# Altium schematic sheet Power.SchDoc: Power
size A4; DocumentNumber: MB1165; Revision: C.1; SheetNumber: 3; SheetTotal: 17; Project: STM32469I-EVAL
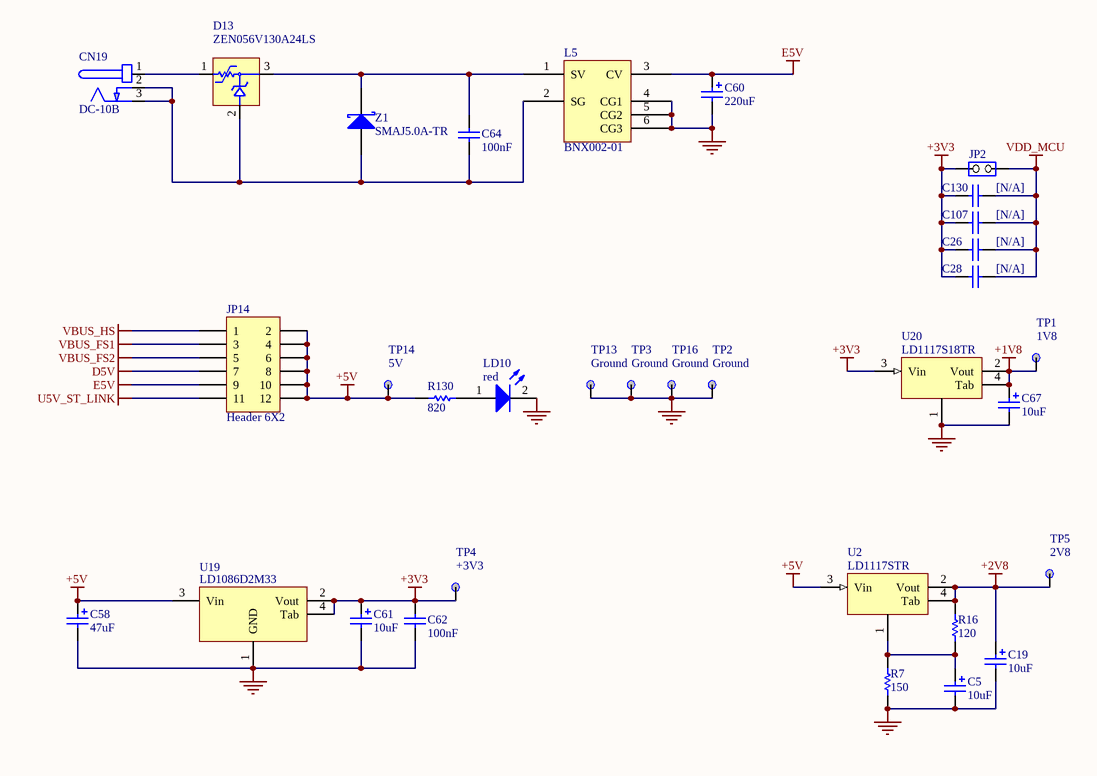
[diagram p0: Power.SchDoc]

## Parts
C5  10uF  [TAN-A]
C19  10uF  [TAN-A]
C26  [N/A]  [0603C]
C28  [N/A]  [0603C]
C58  47uF  [CAE_5R3X5R3_H5R4]
C60  220uF  [c310m-6]
C61  10uF  [TAN-A]
C62  100nF  [0603C]
C64  100nF  [0603C]
C67  10uF  [TAN-A]
C107  [N/A]  [0603C]
C130  [N/A]  [0603C]
CN19  DC-10B  [PWR_JACK_DC10]
D13  ZEN056V130A24LS  [TYCO_ZEN056V130A24LS]
JP2  (no value)  [SIP2]
JP14  Header 6X2  [HDR_2X6_2R54]
L5  BNX002-01  [BNX001]
LD10  red  [0603D]
R7  150  [0603R]
R16  120  [0603R]
R130  820  [0603R]
TP1  1V8  [TP]
TP2  Ground  [TP]
TP3  Ground  [TP]
TP4  +3V3  [TP]
TP5  2V8  [TP]
TP13  Ground  [TP]
TP14  5V  [TP]
TP16  Ground  [TP]
U2  LD1117STR  [SOT-223]
U19  LD1086D2M33  [TO263-3]
U20  LD1117S18TR  [SOT-223]
Z1  SMAJ5.0A-TR  [sma]

## Nets
+1V8: C67.1 TP1.1 U20.2(Vout) U20.4(Tab)
+2V8: C19.1 R16.1 TP5.1 U2.2(Vout) U2.4(Tab)
+3V3: C26.1 C28.1 C61.1 C62.1 C107.1 C130.1 JP2.1(COMMON) TP4.1 U19.2(Vout) U19.4(Tab) U20.3(Vin)
+5V: C58.1 JP14.2 JP14.4 JP14.6 JP14.8 JP14.10 JP14.12 R130.2 TP14.1 U2.3(Vin) U19.3(Vin)
D5V: JP14.7
E5V: C60.1 JP14.9 L5.3(CV)
GND: C5.2 C19.2 C58.2 C60.2 C61.2 C62.2 C67.2 L5.4(CG1) L5.5(CG2) L5.6(CG3) LD10.2(K) R7.2 TP2.1 TP3.1 TP13.1 TP16.1 U19.1(GND) U20.1
U5V_ST_LINK: JP14.11
VBUS_FS1: JP14.3
VBUS_FS2: JP14.5
VBUS_HS: JP14.1
VDD_MCU: C26.2 C28.2 C107.2 C130.2 JP2.2(NO)
NetC5_1: C5.1 R7.1 R16.2 U2.1
NetC64_1: C64.1 D13.3 L5.1(SV) Z1.2(K)
NetC64_2: C64.2 CN19.2(GND) CN19.3(GND) D13.2 L5.2(SG) Z1.1(A)
NetCN19_1: CN19.1(+) D13.1
NetLD10_1: LD10.1(A) R130.1

## Notes on the sheet
- Title:
- Project:
- Size:
- Date:
- A4
- Reference:
- Sheet:
- Revision:
- of

## Library data of the parts
C5 C19 C61 C67 = Cap Pol1: Polarized Capacitor (Radial); Published: 8-Jun-2000; Revision: July-2002: Re-released for DXP Platform.; Publisher: Altium Limited; Value: 10uF
C26 C28 C62 C107 C130 = Cap: Capacitor; Value: 10nF; Published: 8-Jun-2000; Revision: July-2002: Re-released for DXP Platform.; Publisher: Altium Limited
C58 = Cap Pol1: Polarized Capacitor (Radial); Value: 10uF; Published: 8-Jun-2000; Revision: July-2002: Re-released for DXP Platform.; Publisher: Altium Limited
C60 = Cap Pol1: Polarized Capacitor (Radial); Value: 47uF; Published: 8-Jun-2000; Revision: July-2002: Re-released for DXP Platform.; Publisher: Altium Limited
C64 = CAP: Capacitor; Value: 100pF; Published: 8-Jun-2000; Revision: July-2002: Re-released for DXP Platform.; Publisher: Altium Limited
CN19 = PJ202A
JP2 = JP2
JP14 = Header 6X2: Header, 6-Pin, Dual row; Revision: 17-Jul-2002: Re-released for DXP Platform.; Publisher: Altium Limited
L5 = BNX002
LD10 = LED2: Typical RED, GREEN, YELLOW, AMBER GaAs LED; Published: 8-Jun-2000; Revision: July-2002: Re-released for DXP Platform.; Publisher: Altium Limited
R7 R16 R130 = res1: Resistor; Value: 1K; Published: 8-Jun-2000; Revision: July-2002: Re-released for DXP Platform.; Publisher: Altium Limited
TP1-TP5 TP13 TP14 TP16 = TP
U2 U20 = LD1117
U19 = VOLTREG1
Z1 = D Schottky: Schottky Diode; Code - JEDEC: DO-214-AA; Published: 8-Jun-2000; Revision: July-2002: Re-released for DXP Platform.; Publisher: Altium Limited